# Altium schematic sheet sd.schdoc: SD
size A4; Date: 10.03.2026; CheckedBy: BCY; DrawnBy: miaow; Revision: v1.0.0; SheetNumber: 9; SheetTotal: 18; BoardType: MAIN_PCB; Desc: Micro SD socket
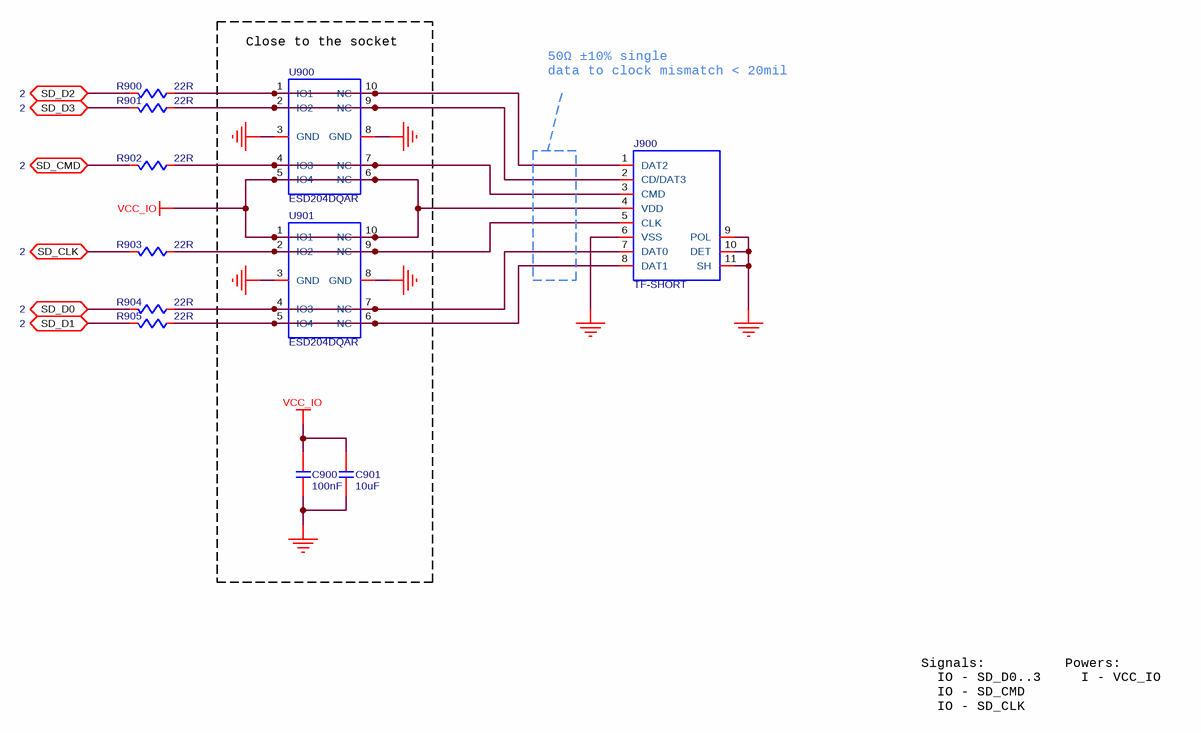
[diagram p0: sd.schdoc]

## Parts
C900  value 100nF  [C0402]  (hidden comment: C-NOMO)
C901  value 10uF  [C0402]  (hidden comment: C-NOMO)
J900  TF-SHORT  [TF-SHORT]
R900  value 22R  [R0402]  (hidden comment: R)
R901  value 22R  [R0402]  (hidden comment: R)
R902  value 22R  [R0402]  (hidden comment: R)
R903  value 22R  [R0402]  (hidden comment: R)
R904  value 22R  [R0402]  (hidden comment: R)
R905  value 22R  [R0402]  (hidden comment: R)
U900  ESD204DQAR  [ESD204DQAR]
U901  ESD204DQAR  [ESD204DQAR]

## Blocks framed on the sheet
Close to the socket: C900 C901 U900 U901

## Ports
SD_CLK (bidir, see 2), SD_CMD (bidir, see 2), SD_D0 (bidir, see 2), SD_D1 (bidir, see 2), SD_D2 (bidir, see 2), SD_D3 (bidir, see 2)

## Nets
GND: C900.2 C901.2 J900.6(VSS) J900.9(POL) J900.10(DET) J900.11(SH) U900.3(GND) U900.8(GND) U901.3(GND) U901.8(GND)
VCC_IO: C900.1 C901.1 J900.4(VDD) U900.5(IO4) U900.6(NC) U901.1(IO1) U901.10(NC)
SD_CLK: R903.1 ; port SD_CLK
SD_CMD: R902.1 ; port SD_CMD
SD_D0: R904.1 ; port SD_D0
SD_D1: R905.1 ; port SD_D1
SD_D2: R900.1 ; port SD_D2
SD_D3: R901.1 ; port SD_D3
NetJ900_1: J900.1(DAT2) R900.2 U900.1(IO1) U900.10(NC)
NetJ900_2: J900.2(CD/DAT3) R901.2 U900.2(IO2) U900.9(NC)
NetJ900_3: J900.3(CMD) R902.2 U900.4(IO3) U900.7(NC)
NetJ900_5: J900.5(CLK) R903.2 U901.2(IO2) U901.9(NC)
NetJ900_7: J900.7(DAT0) R904.2 U901.4(IO3) U901.7(NC)
NetJ900_8: J900.8(DAT1) R905.2 U901.5(IO4) U901.6(NC)

## Notes on the sheet
- 50Ω ±10% single
- data to clock mismatch < 20mil
- Signals:
  IO - SD_D0..3
  IO - SD_CMD
  IO - SD_CLK
- Powers:
  I - VCC_IO
- DRAWN
- CHECKED
- DRAWNBY
- SHEETS
- SHEETS_NO

## Library data of the parts
C900 = C-NOMO: voltage: 50V; precision: 10%; Supplier 1: LCSC; Supplier Part Number 1: C307331
C901 = C-NOMO: voltage: 6.3V; precision: 20%; Supplier 1: LCSC; Supplier Part Number 1: C15525
J900 = TF-SHORT: SOCKET - MicroSD socket with detction; Supplier 1: LCSC; Supplier Part Number 1: C50380694
R900-R905 = R: precision: 1%; Supplier 1: LCSC; Supplier Part Number 1: C25092
U900 U901 = ESD204DQAR: TVS/ESD - 4 ch, 3.6V, 5V, 0.55pF@1MHz, 30KV; Supplier 1: LCSC; Supplier Part Number 1: C553132